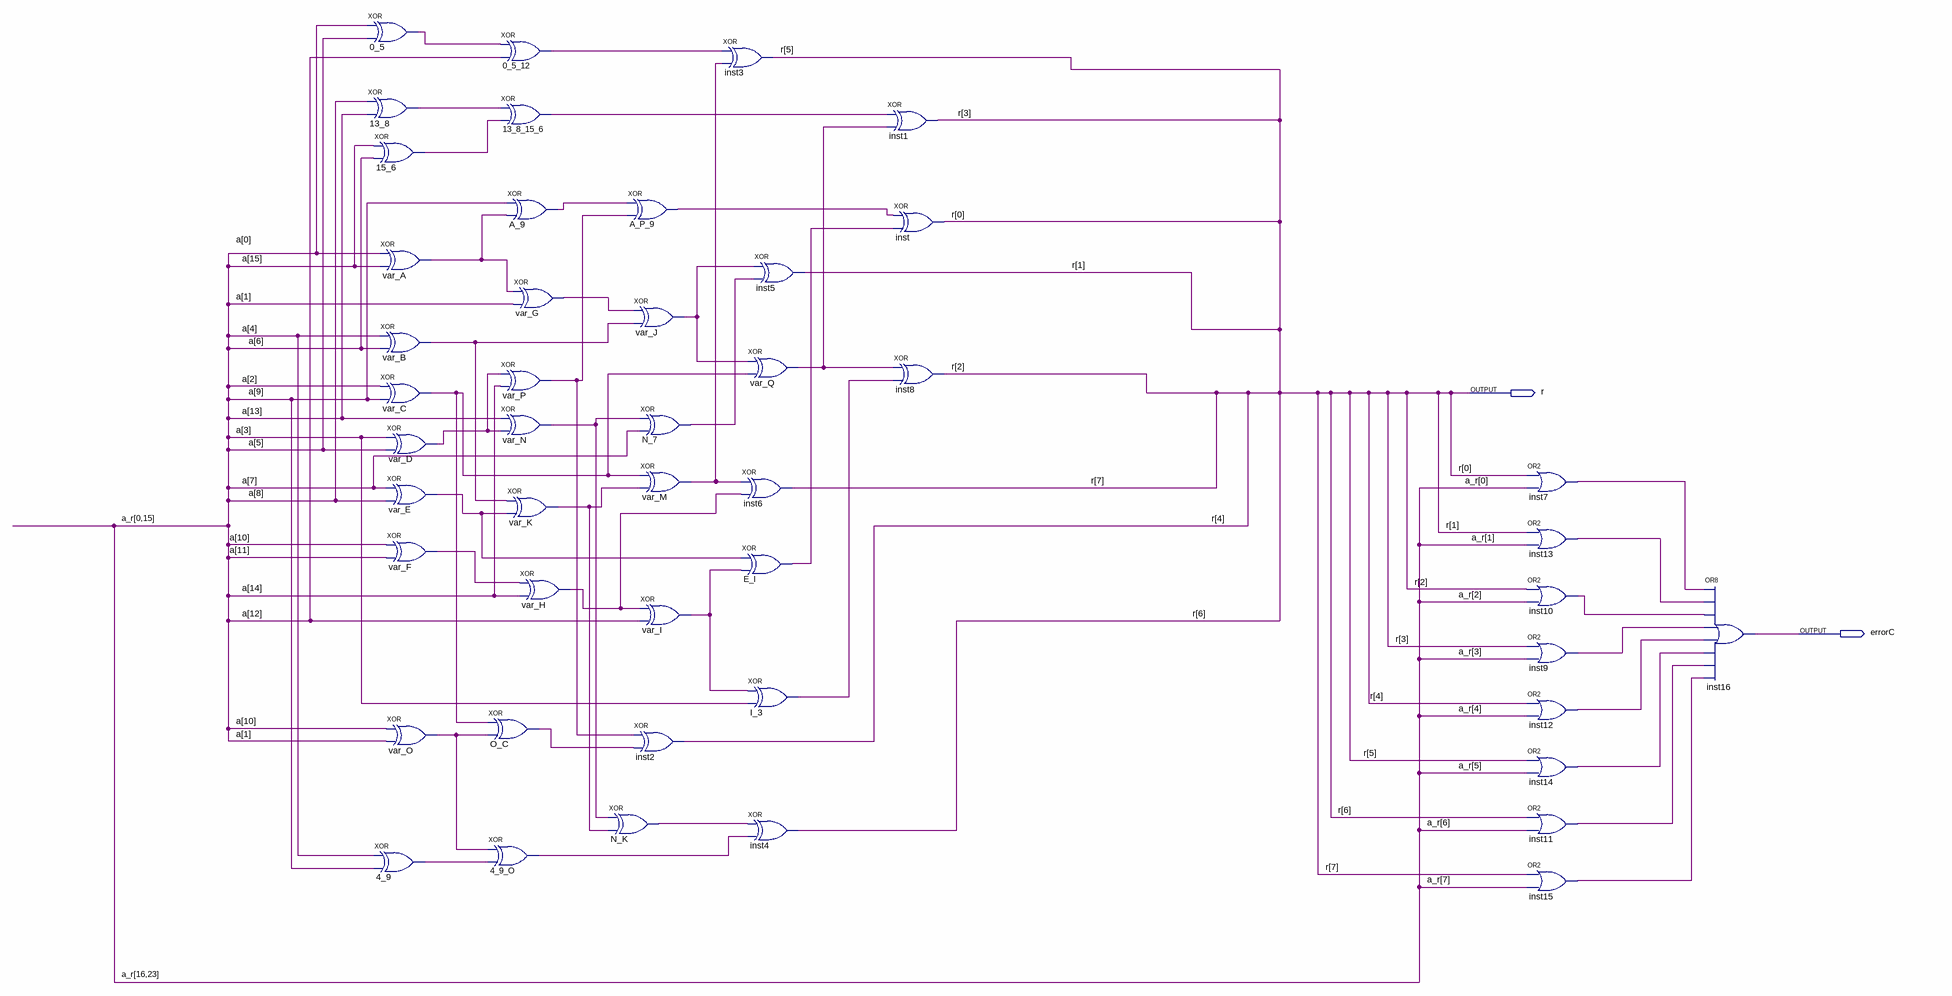
[diagram p0: schematic sheet]
// Quartus schematic CheckerBDF.bdf as structural Verilog: 47 symbols, 2 pins
module CheckerBDF (
  output r,
  output errorC
);

  wire A_9_out, A_P_9_out, E_I_out, I_3_out, inst7_out, inst9_out, inst10_out, inst11_out, inst12_out,
       inst13_out, inst14_out, inst15_out, n0_5_12_out, n0_5_out, n4_9_O_out, n4_9_out, n13_8_15_6_out,
       n13_8_out, n15_6_out, N_7_out, N_K_out, O_C_out, var_A_out, var_B_out, var_C_out, var_D_out,
       var_E_out, var_F_out, var_G_out, var_H_out, var_I_out, var_J_out, var_K_out, var_M_out, var_N_out,
       var_O_out, var_P_out, var_Q_out;
  wire [7:1] a_r;
  wire [15:2] a;

  xor u_0_5 (n0_5_out, a[15], a[5]);
  xor u_13_8 (n13_8_out, a[8], a[13]);
  xor u_15_6 (n15_6_out, a[15], a[6]);
  xor var_A (var_A_out, a[15], a[15]);
  xor var_B (var_B_out, a[4], a[6]);
  xor var_C (var_C_out, a[2], a[9]);
  xor var_D (var_D_out, a[3], a[5]);
  xor var_E (var_E_out, a[7], a[8]);
  xor var_F (var_F_out, a[10], a[11]);
  xor var_O (var_O_out, a[10], a[10]);
  xor u_4_9 (n4_9_out, a[4], a[9]);
  xor u_0_5_12 (n0_5_12_out, n0_5_out, a[12]);
  xor u_13_8_15_6 (n13_8_15_6_out, n13_8_out, n15_6_out);
  xor A_9 (A_9_out, a[9], var_A_out);
  xor var_G (var_G_out, var_A_out, a[10]);
  xor var_P (var_P_out, var_D_out, a[14]);
  xor var_N (var_N_out, a[13], var_D_out);
  xor var_K (var_K_out, var_B_out, var_E_out);
  xor O_C (O_C_out, var_C_out, var_O_out);
  xor u_4_9_O (n4_9_O_out, var_O_out, n4_9_out);
  xor var_H (var_H_out, var_F_out, a[14]);
  xor N_K (N_K_out, var_N_out, var_K_out);
  xor A_P_9 (A_P_9_out, A_9_out, var_P_out);
  xor var_J (var_J_out, var_G_out, var_B_out);
  xor N_7 (N_7_out, var_N_out, a[7]);
  xor var_M (var_M_out, var_C_out, var_K_out);
  xor var_I (var_I_out, var_H_out, a[12]);
  xor inst2 (r, var_P_out, O_C_out);
  xor inst3 (r, n0_5_12_out, var_M_out);
  xor inst5 (r, var_J_out, N_7_out);
  xor var_Q (var_Q_out, var_J_out, var_C_out);
  xor inst6 (r, var_M_out, var_H_out);
  xor E_I (E_I_out, var_E_out, var_I_out);
  xor I_3 (I_3_out, var_I_out, a[3]);
  xor inst4 (r, N_K_out, n4_9_O_out);
  xor inst1 (r, n13_8_15_6_out, var_Q_out);
  xor inst (r, A_P_9_out, E_I_out);
  xor inst8 (r, var_Q_out, I_3_out);
  or inst7 (inst7_out, r, a_r[1]);
  or inst13 (inst13_out, r, a_r[1]);
  or inst10 (inst10_out, r, a_r[2]);
  or inst9 (inst9_out, r, a_r[3]);
  or inst12 (inst12_out, r, a_r[4]);
  or inst14 (inst14_out, r, a_r[5]);
  or inst11 (inst11_out, r, a_r[6]);
  or inst15 (inst15_out, r, a_r[7]);
  or inst16 (errorC, inst7_out, inst13_out, inst10_out, inst9_out, inst12_out, inst14_out, inst11_out, inst15_out);

  // Other names for the same wires on the sheet: a[1:0] = {a[10], a[15]}; a_r[0] = a_r[1]; r[7:0] = {8{r}}
endmodule
